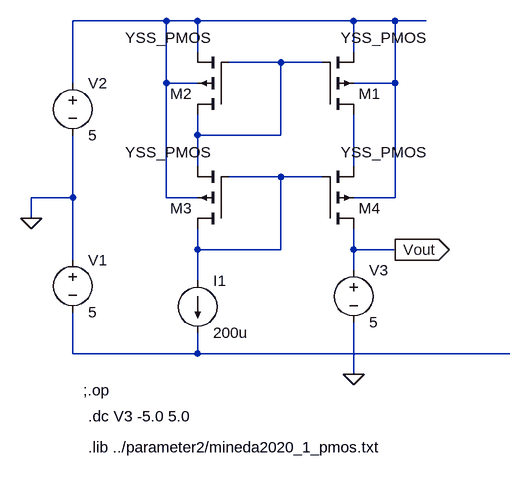
[diagram p0: schematic currentsource_test14umcascode.asc]
currentsource_test14umcascode.asc, the LTspice schematic file:
Version 4
SHEET 1 1536 2968
WIRE -368 -192 -512 -192
WIRE -320 -192 -368 -192
WIRE -80 -192 -320 -192
WIRE -16 -192 -80 -192
WIRE 32 -192 -16 -192
WIRE -320 -144 -320 -192
WIRE -80 -144 -80 -192
WIRE -192 -128 -272 -128
WIRE -128 -128 -192 -128
WIRE -512 -96 -512 -192
WIRE -368 -96 -368 -192
WIRE -320 -96 -368 -96
WIRE -16 -96 -16 -192
WIRE -16 -96 -80 -96
WIRE -320 -16 -320 -48
WIRE -192 -16 -192 -128
WIRE -192 -16 -320 -16
WIRE -320 32 -320 -16
WIRE -80 32 -80 -48
WIRE -192 48 -272 48
WIRE -128 48 -192 48
WIRE -512 80 -512 -16
WIRE -512 80 -576 80
WIRE -368 80 -368 -96
WIRE -320 80 -368 80
WIRE -16 80 -16 -96
WIRE -16 80 -80 80
WIRE -576 112 -576 80
WIRE -320 160 -320 128
WIRE -192 160 -192 48
WIRE -192 160 -320 160
WIRE -80 160 -80 128
WIRE -16 160 -80 160
WIRE -512 176 -512 80
WIRE -80 192 -80 160
WIRE -320 208 -320 160
WIRE -512 320 -512 256
WIRE -320 320 -320 288
WIRE -320 320 -512 320
WIRE 160 320 -320 320
WIRE -80 352 -80 272
FLAG -576 112 0
FLAG -16 160 Vout
IOPIN -16 160 Out
FLAG -80 352 0
SYMBOL voltage -512 160 R0
WINDOW 123 0 0 Left 2
WINDOW 39 0 0 Left 2
SYMATTR InstName V1
SYMATTR Value 5
SYMBOL pmos4 -128 -48 M180
WINDOW 3 28 118 Left 2
SYMATTR Value YSS_PMOS
SYMATTR InstName M1
SYMATTR Value2 l=14u w=14u m=20
SYMBOL voltage -512 -112 R0
WINDOW 123 0 0 Left 2
WINDOW 39 0 0 Left 2
SYMATTR InstName V2
SYMATTR Value 5
SYMBOL current -320 208 R0
WINDOW 123 0 0 Left 2
WINDOW 39 0 0 Left 2
SYMATTR InstName I1
SYMATTR Value 200u
SYMBOL pmos4 -272 -48 R180
WINDOW 3 28 118 Left 2
SYMATTR Value YSS_PMOS
SYMATTR InstName M2
SYMATTR Value2 l=14u w=14u m=20
SYMBOL voltage -80 176 R0
WINDOW 123 0 0 Left 2
WINDOW 39 0 0 Left 2
SYMATTR InstName V3
SYMATTR Value 5
SYMBOL pmos4 -272 128 R180
WINDOW 3 28 118 Left 2
SYMATTR Value YSS_PMOS
SYMATTR InstName M3
SYMATTR Value2 l=14u w=14u m=20
SYMBOL pmos4 -128 128 M180
WINDOW 3 28 118 Left 2
SYMATTR Value YSS_PMOS
SYMATTR InstName M4
SYMATTR Value2 l=14u w=14u m=20
TEXT -488 416 Left 2 !.dc V3 -5.0 5.0 
TEXT -488 464 Left 2 !.lib ../parameter2/mineda2020_1_pmos.txt
TEXT -496 376 Left 2 !;.op

The netlist it stands for:
* currentsource_test14umcascode.asc
V1 0 N005 5
M1 N003 N002 N001 N001 YSS_PMOS l=14u w=14u m=20
V2 N001 0 5
I1 N004 N005 200u
M2 N002 N002 N001 N001 YSS_PMOS l=14u w=14u m=20
V3 Vout 0 5
M3 N004 N004 N002 N001 YSS_PMOS l=14u w=14u m=20
M4 Vout N004 N003 N001 YSS_PMOS l=14u w=14u m=20
.model NMOS NMOS
.model PMOS PMOS
.lib standard.mos
.dc V3 -5.0 5.0
.lib ../parameter2/mineda2020_1_pmos.txt
;.op
.backanno
.end